# EasyEDA Pro project 单向户外电源_明月班.epro, board PCB10
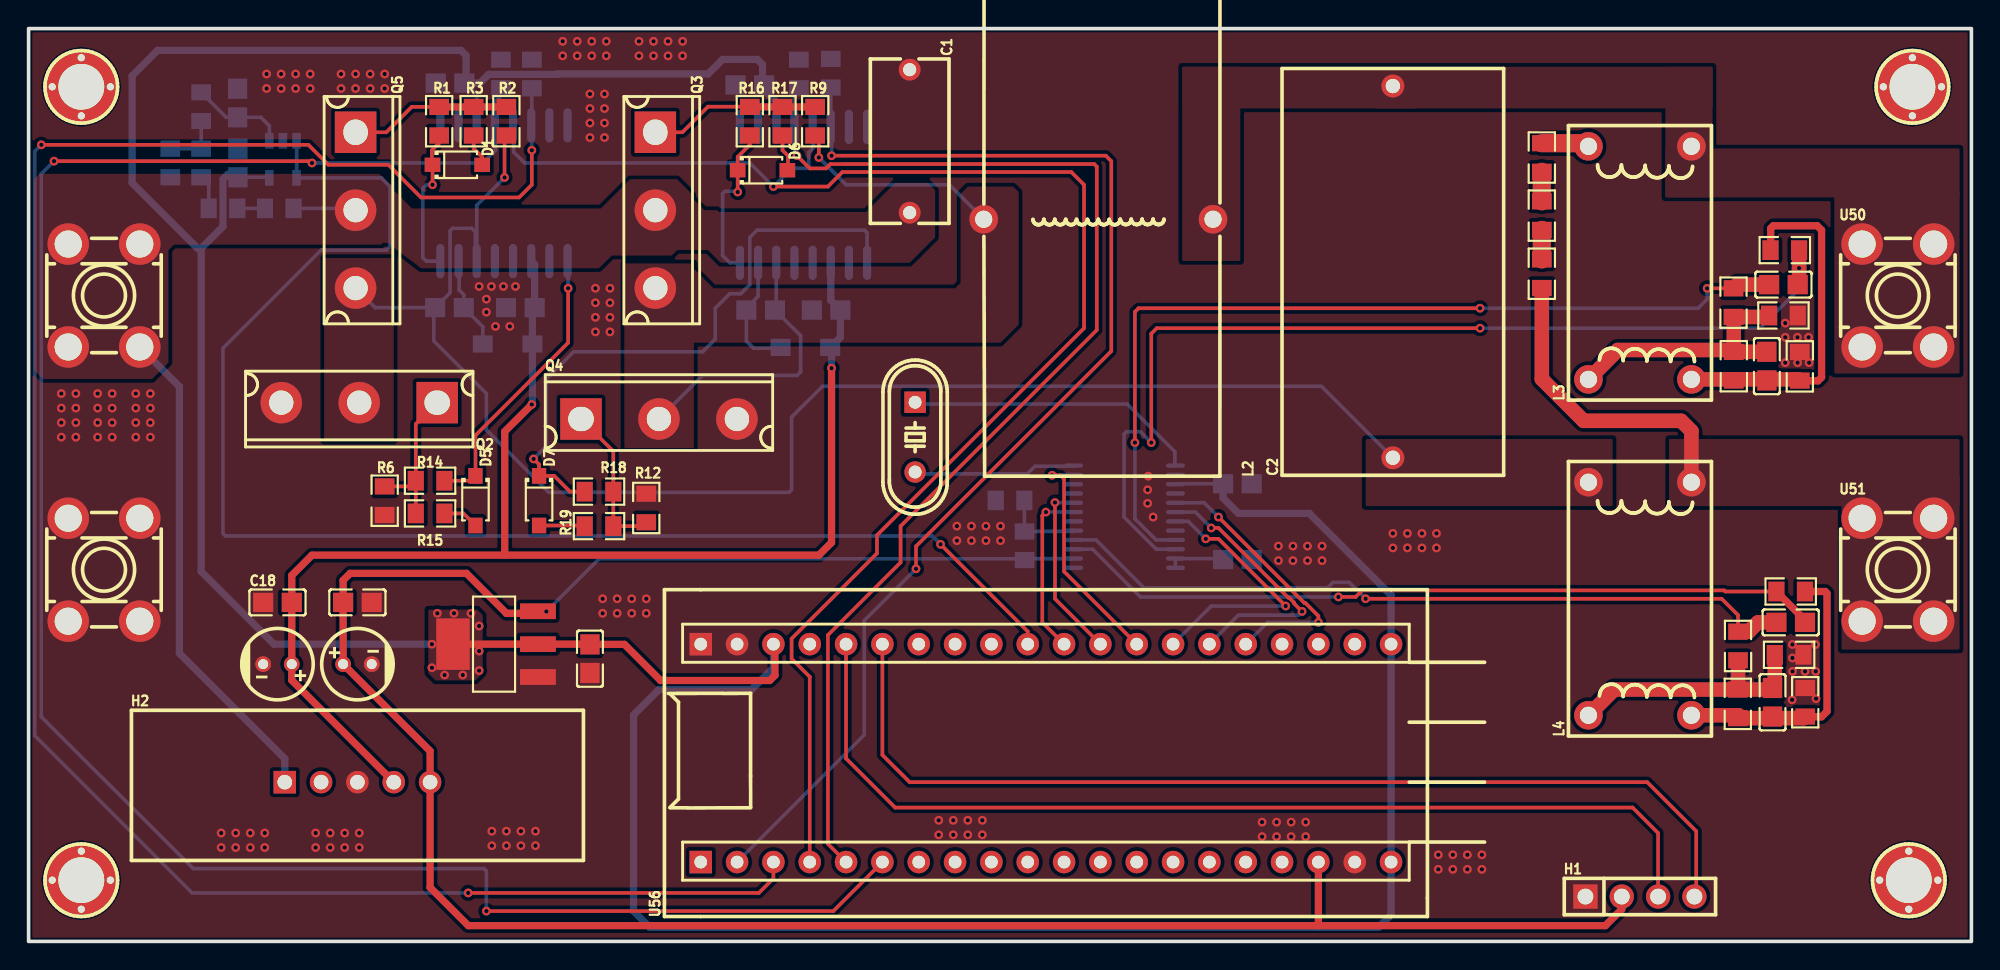
[diagram p16: board, top side]
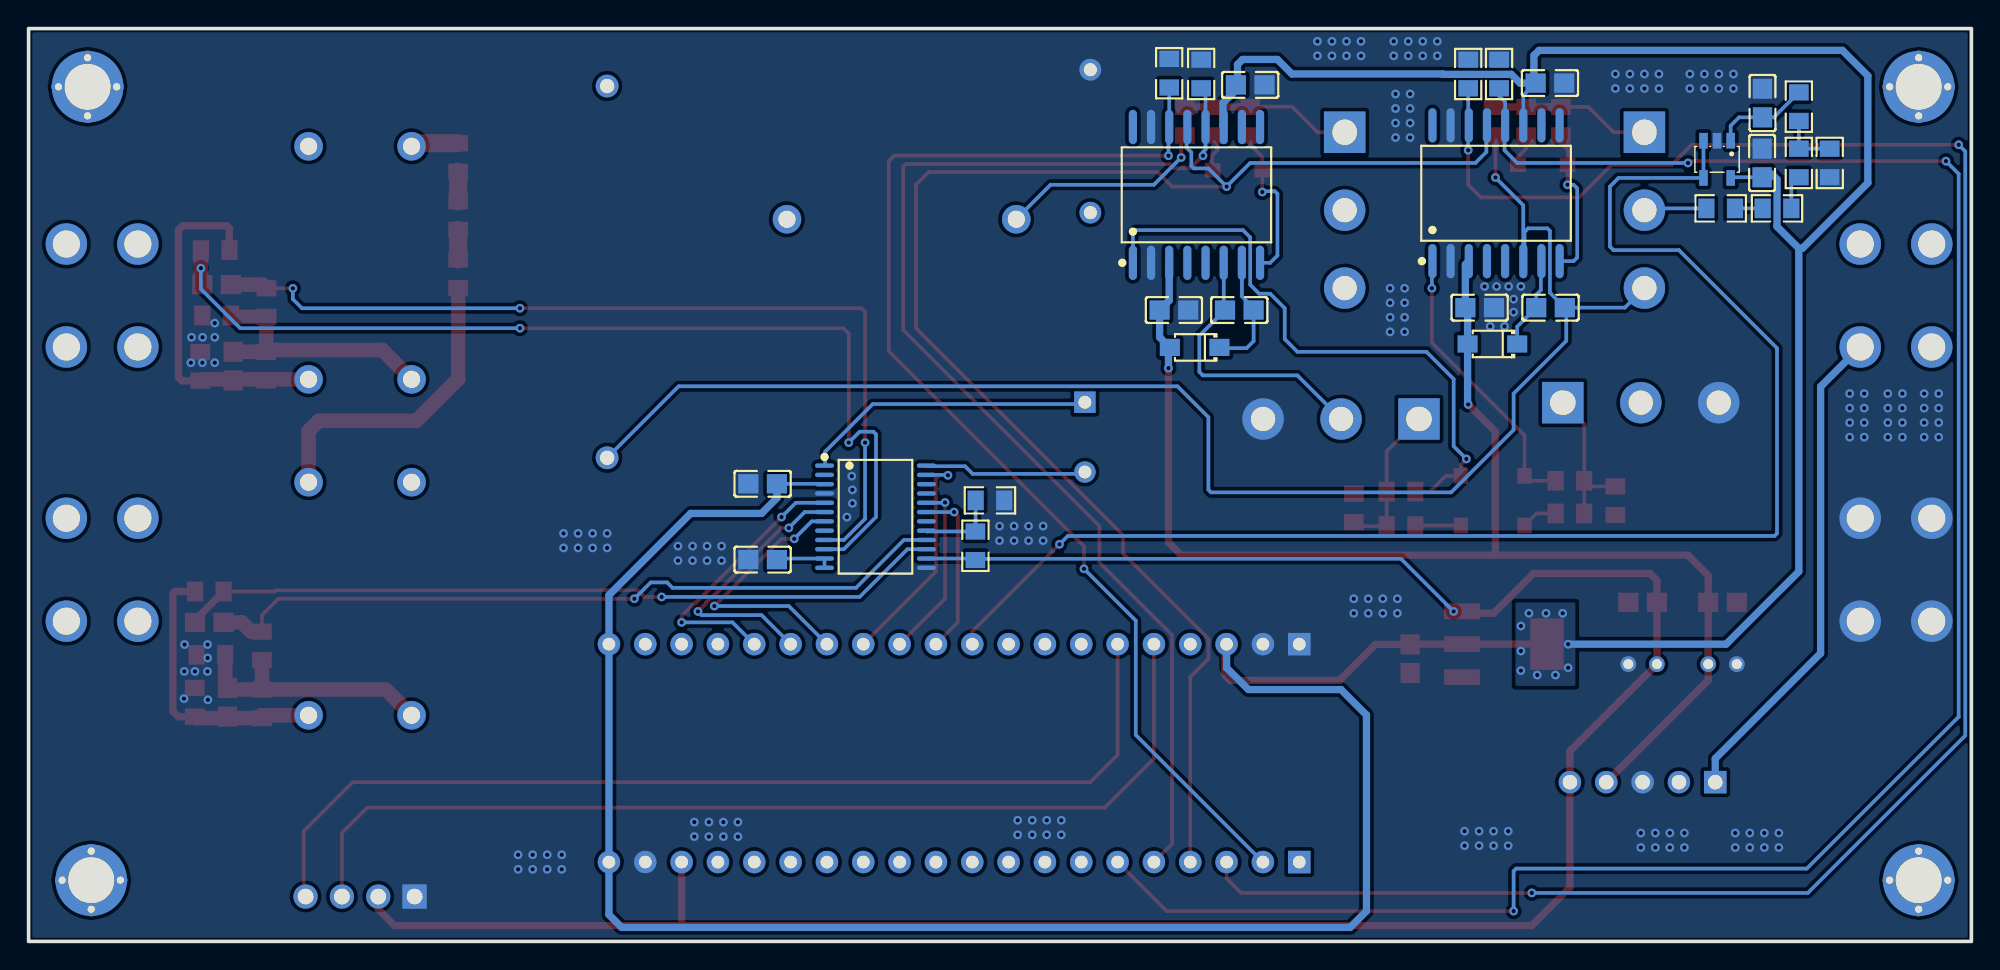
[diagram p17: board, bottom side, seen from below]

Outline 135.82 x 63.84 mm; copper layers: Top Layer, Bottom Layer. Coordinates in mm from the lower left corner of the outline.
Outline path: rectangle 0,63.84 135.82,0
Stack: Top Layer 0.035mm / Dielectric1 1.51mm FR4 er 4.5 / Bottom Layer 0.035mm

## Design rules (mm)
template: 自定义配置
spacing copperThickness1oz (default): track to track 0.102, other pairs 0.152 to 0.3
spacing copperThickness2oz: track to track 0.203, other pairs 0.152 to 0.3
track width copperThickness1oz (default): min 0.127, default 0.254, max 2.54
track width copperThickness2oz: min 0.203, default 0.254, max 2.54
differential pair differentialPair (default): width min 0.127, default 0.254, max 2.54; gap min 0.152, default 0.152
via viaSize (default): diameter min 0.5, default 0.61, max 10; hole min 0.3, default 0.305, max 6.3

## Placement (name value [footprint] x y rotation side)
C1  100nF  [CAP-TH_L11.5-W5.5-P10.00-D0.6]  61.59 55.97 270 top
C2  4.7uF  [CAP-TH_L28.5-W15.5-P26.0-D0.8]  95.38 46.82 90 top
C3  100nF  [C0805]  14.63 54.44 90 bottom
C4  100nF  [C0805]  14.6 58.64 270 bottom
C5  10uF  [C0805]  29.42 44.33 0 bottom
C6  100nF  [C0805]  34.38 44.33 0 bottom
C7  100nF  [C0805]  29.46 60.03 0 bottom
C8  10uF  [C0805]  51.18 44.16 180 bottom
C9  100nF  [C0805]  55.75 44.16 0 bottom
C10  100nF  [C0805]  50.42 59.91 0 bottom
C11  10pF  [C0805]  121.52 40.24 90 top
C12  4.7nF  [C0805]  122.68 45.94 180 top
C13  10pF  [C0805]  121.92 16.73 90 top
C14  4.7nF  [C0805]  123.19 22.31 180 top
C15  100nF  [C0805]  84.51 32.01 0 bottom
C16  100nF  [C0805]  84.51 26.7 180 bottom
C17  100uF  [CAP-TH_BD5.0-P2.00-D0.5-FD-1]  17.4 19.39 180 top
C18  100nF  [C0805]  17.4 23.71 0 top
C19  100uF  [CAP-TH_BD5.0-P2.00-D0.5-FD-1]  22.99 19.39 0 top
C20  100nF  [C0805]  22.99 23.71 180 top
C21  100nF  [C0805]  39.24 19.77 90 top
D1  1N4148W  [SOD-123F_L2.7-W1.6-LS3.8-RD]  29.97 54.32 0 top
D5  1N4148W  [SOD-123F_L2.7-W1.6-LS3.8-RD]  31.24 30.82 270 top
D6  1N4148W  [SOD-123F_L2.7-W1.6-LS3.8-RD]  51.31 53.94 0 top
D7  1N4148W  [SOD-123F_L2.7-W1.6-LS3.8-RD]  35.69 30.82 270 top
D8  FR107W  [SOD-123FL_L2.7-W1.8-LS3.8-RD]  33.49 41.79 0 bottom
D9  FR107W  [SOD-123FL_L2.7-W1.8-LS3.8-RD]  54.3 41.54 0 bottom
H1  -  [HDR-TH_4P-P2.54-V-F]  112.65 3.14 0 top
H2  -  [EG1185辅助电源]  22.99 11.14 0 top
L2  2mH  [2mH-D=36,插件脚距16]  74.8 50.51 90 top
L3  ZMPT107-1  [XFMR-TH_ZMPT107-1]  112.65 47.46 90 top
L4  ZMPT107-1  [XFMR-TH_ZMPT107-1]  112.65 23.96 90 top
P8  -  [固定孔]  131.7 59.77 0 top
P9  -  [固定孔]  3.68 59.77 0 top
P10  -  [固定孔]  131.44 4.28 0 top
P11  -  [固定孔]  3.68 4.28 0 top
Q2  K40EH5  [TO-247AC-3_L15.8-W5.0-P5.46-L]  23.11 37.68 180 top
Q3  K40EH5  [TO-247AC-3_L15.8-W5.0-P5.46-L]  43.81 51.14 270 top
Q4  K40EH5  [TO-247AC-3_L15.8-W5.0-P5.46-L]  44.07 36.54 0 top
Q5  K40EH5  [TO-247AC-3_L15.8-W5.0-P5.46-L]  22.86 51.14 270 top
R1  20R  [R0805]  28.7 57.37 90 top
R2  10K  [R0805]  33.4 57.37 270 top
R3  4.7R  [R0805]  31.11 57.37 90 top
R6  10K  [R0805]  24.89 30.82 270 top
R9  10K  [R0805]  54.99 57.37 270 top
R12  10K  [R0805]  43.18 30.31 90 top
R14  20R  [R0805]  28.07 32.22 180 top
R15  4.7R  [R0805]  28.07 29.93 180 top
R16  20R  [R0805]  50.42 57.37 90 top
R17  4.7R  [R0805]  52.7 57.37 90 top
R18  20R  [R0805]  39.88 31.46 0 top
R19  4.7R  [R0805]  39.88 29.04 0 top
R20  1K  [R0805]  12.06 58.38 90 bottom
R21  7.5K  [R0805]  9.91 54.44 90 bottom
R22  330K  [R0805]  12.06 54.44 270 bottom
R23  330K  [R0805]  17.53 51.27 180 bottom
R24  330K  [R0805]  13.59 51.27 180 bottom
R25  10K  [R0805]  33.02 60.67 270 bottom
R26  10K  [R0805]  35.18 60.67 270 bottom
R27  10K  [R0805]  53.85 60.67 270 bottom
R28  10K  [R0805]  56.08 60.72 270 bottom
R29  100K  [R0805]  105.79 46.7 90 top
R30  100K  [R0805]  105.79 50.76 90 top
R31  20K  [R0805]  105.79 54.83 90 top
R32  100R  [R0805]  119.21 40.23 90 top
R33  1K  [R0805]  122.68 43.78 0 top
R34  1K  [R0805]  123.83 40.22 90 top
R35  470R  [R0805]  119.19 44.68 270 top
R36  470R  [R0805]  122.78 48.35 180 top
R40  20R  [R0805]  119.49 16.61 90 top
R41  1K  [R0805]  124.21 16.73 90 top
R42  1K  [R0805]  123.08 20.04 0 top
R43  470R  [R0805]  119.51 20.66 270 top
R44  470R  [R0805]  123.19 24.47 0 top
R45  10K  [R0805]  68.62 30.85 180 bottom
R46  5.1K  [R0805]  69.63 27.67 270 bottom
U48  T44001  [CONN-TH_T44001]  5.27 45.17 0 top
U49  T44001  [CONN-TH_T44001]  5.27 26 0 top
U50  T44001  [CONN-TH_T44001]  130.68 45.17 0 top
U51  T44001  [CONN-TH_T44001]  130.68 26 0 top
U52  LMV321IDBVR  [SOT-23-5_L3.0-W1.7-P0.95-LS2.8-BR]  17.78 54.7 90 bottom
U53  IR2110STRPBF  [SOIC-16_L10.3-W7.5-P1.27-LS10.3-BL]  33.23 52.33 180 bottom
U54  IR2110STRPBF  [SOIC-16_L10.3-W7.5-P1.27-LS10.3-BL]  54.18 52.21 180 bottom
U55  CS5463-ISZR  [SSOP-24_L8.1-W5.3-P0.65-LS7.8-BL]  76.62 29.7 270 bottom
U56  -  [STM32F103C8T6最小系统板]  77.47 13.17 90 top
U57  AMS1117-3.3  [SOT-223-3_L6.5-W3.4-P2.30-LS7.0-BR]  32.64 20.79 0 top
X1  4.096MHz  [HC-49US_L11.5-W4.5-P4.88]  61.98 35.27 270 top

## Footprints (pads in the part's own frame, mm; a bottom-side part is the same pattern mirrored in y, then rotated)
2mH-D=36,插件脚距16
  round 2 hole 1.2: 1(0,8.031) 2(0,-8.001)
C0805
  rect 1.41x1.35 smd: 1(-1,0) 2(1,0)
CAP-TH_BD5.0-P2.00-D0.5-FD-1
  round 1.1 hole 0.7: 1(-1,0) 2(1,0)
CAP-TH_L11.5-W5.5-P10.00-D0.6
  round 1.524 hole 0.914: 1(-5,0) 2(5,0)
CAP-TH_L28.5-W15.5-P26.0-D0.8
  round 1.6 hole 1: 1(-13,0) 2(13,0)
CONN-TH_T44001
  round 2.9 hole 1.9: 1(-2.5,3.6) 2(-2.5,-3.6) 3(2.5,-3.6) 4(2.5,3.6)
EG1185辅助电源
  rect 1.575x1.575 hole 1.02: 1(-5.08,0)
  round 1.575 hole 1.02: 2(-2.54,0) 3(0,0) 4(2.54,0) 5(5.08,0)
HC-49US_L11.5-W4.5-P4.88
  rect 1.5x1.5 hole 0.9: 1(-2.44,0)
  round 1.5 hole 0.9: 2(2.44,0)
HDR-TH_4P-P2.54-V-F
  rect 1.7x1.7 hole 1.1: 1(-3.81,0)
  round 1.7 hole 1.1: 2(-1.27,0) 3(1.27,0) 4(3.81,0)
R0805
  rect 1.133x1.377 smd: 1(-1,0) 2(1,0)
SOD-123F_L2.7-W1.6-LS3.8-RD
  rect 1.1x1 smd: 1(-1.735,0) 2(1.735,0)
SOD-123FL_L2.7-W1.8-LS3.8-RD
  rect 1.4x1.2 smd: 1(-1.735,0) 2(1.735,0)
SOIC-16_L10.3-W7.5-P1.27-LS10.3-BL
  oval 0.574x2.401 smd: 1(-4.445,-4.75) 2(-3.175,-4.75) 3(-1.905,-4.75) 4(-0.635,-4.75) 5(0.635,-4.75) 6(1.905,-4.75) 7(3.175,-4.75) 8(4.445,-4.75) 9(4.445,4.75) 10(3.175,4.75) 11(1.905,4.75) 12(0.635,4.75) 13(-0.635,4.75) 14(-1.905,4.75) 15(-3.175,4.75) 16(-4.445,4.75)
SOT-23-5_L3.0-W1.7-P0.95-LS2.8-BR
  rect 1.1x0.6 smd: 1(1.3,-0.95) 2(1.3,0) 3(1.3,0.95) 4(-1.3,0.95) 5(-1.3,-0.95)
SOT-223-3_L6.5-W3.4-P2.30-LS7.0-BR
  rect 2.5x1.1 smd: 1(2.97,-2.3) 2(2.97,0) 3(2.97,2.3)
  rect 2.34x3.6 smd: 4(-2.97,0)
SSOP-24_L8.1-W5.3-P0.65-LS7.8-BL
  oval 0.308x1.324 smd: 1(-3.575,-3.562) 2(-2.925,-3.562) 3(-2.275,-3.562) 4(-1.625,-3.562) 5(-0.975,-3.562) 6(-0.325,-3.562) 7(0.325,-3.562) 8(0.975,-3.562) 9(1.625,-3.562) 10(2.275,-3.562) 11(2.925,-3.562) 12(3.575,-3.562) 13(3.575,3.562) 14(2.925,3.562) 15(2.275,3.562) 16(1.625,3.562) 17(0.975,3.562) 18(0.325,3.562) 19(-0.325,3.562) 20(-0.975,3.562) 21(-1.625,3.562) 22(-2.275,3.562) 23(-2.925,3.562) 24(-3.575,3.562)
STM32F103C8T6最小系统板
  round 1.575 hole 0.889: 1(7.62,-17.78) 2(7.62,-15.24) 3(7.62,-12.7) 4(7.62,-10.16) 5(7.62,-7.62) 6(7.62,-5.08) 7(7.62,-2.54) 8(7.62,0) 9(7.62,2.54) 10(7.62,5.08) 11(7.62,7.62) 12(7.62,10.16) 13(7.62,12.7) 14(7.62,15.24) 15(7.62,17.78) 16(7.62,20.32) 17(7.62,22.86) 18(7.62,25.4) 19(7.62,27.94) 22(-7.62,27.94) 23(-7.62,25.4) 24(-7.62,22.86) 25(-7.62,20.32) 26(-7.62,17.78) 27(-7.62,15.24) 28(-7.62,12.7) 29(-7.62,10.16) 30(-7.62,7.62) 31(-7.62,5.08) 32(-7.62,2.54) 33(-7.62,0) 34(-7.62,-2.54) 35(-7.62,-5.08) 36(-7.62,-7.62) 37(-7.62,-10.16) 38(-7.62,-12.7) 39(-7.62,-15.24) 40(-7.62,-17.78)
  rect 1.575x1.575 hole 0.889: 20(7.62,30.48) 21(-7.62,30.48)
TO-247AC-3_L15.8-W5.0-P5.46-L
  rect 2.9x2.9 hole 1.785x1.7: 1(-5.45,0)
  round 2.9 hole 1.7: 2(0,0) 3(5.45,0)
XFMR-TH_ZMPT107-1
  round 2 hole 1.2: 1(-8.15,3.6) 2(-8.15,-3.6) 3(8.15,3.6) 4(8.15,-3.6)
固定孔
  round 1 hole 0.5x0.505: 1(-2.032,0) 3(2.032,0)
  round 1 hole 0.505x0.5: 2(0,-2.032) 4(0,2.032)
  round 5 hole 3.205x3.2: 5(0,0)

## Nets
As in the schematic.

Pads without a net: H2 2; P8 1 2 3 4 5; P9 1 2 3 4 5; P10 1 2 3 4 5; P11 1 2 3 4 5; U53 4 5 9 10 16; U54 4 5 9 10 16; U55 2 8 18 21 22; U56 2 3 4 12 13 14 17 21 27 28 29 30 31 32 33 34 35 36 37

## Via types
v1: diameter 0.61, hole 0.305, Top Layer to Bottom Layer, 226 vias

## Routing (per net, layer and track width the routed paths; a pad name or vN(x,y) marks a point on that pad's centre or on a via; arc(x,y) is an arc through that point)
3.3V: length 267.5
  Top Layer w0.508: U57.4 U57.2 39.23,20.79 C21.2 41.66,20.77 44.18,18.25 51.82,18.25 52.17,18.61 52.17,20.68 52.07,20.79
  Bottom Layer w0.254: 14.65,53.44 16.78,53.44 U52.5 ; C15.1 80.21,32.01 U55.3 ; C7.2 31.33,59.17 U53.11
  Bottom Layer w0.508: 52.07,20.79 52.07,19.14 50.55,17.61 44.07,17.61 42.29,15.84 42.29,2.12 43.43,0.98 94.36,0.98 95.25,1.87 U56.40 U56.1 95.25,24.22 89.53,29.93 84.58,29.93 83.51,31.01 C15.1 ; 14.14,53.44 C3.1 14.65,53.44 ; 12.06,48.48 11.81,48.48 7.24,53.05 7.24,60.54 9.02,62.32 30.23,62.32 30.58,61.96 30.58,60.15 C7.2 31.56,60.03 32.16,60.64 36.93,60.64 36.96,60.67 47.5,60.67 48.51,61.68 50.95,61.68 51.31,61.32 51.31,60.02 C10.2 51.42,59.54 52.32,58.64 52.32,57.02 U54.11 ; 12.06,48.48 13.59,50 13.59,53.3 13.95,53.66 14.14,53.47 ; 12.06,48.48 12.06,25.87 17.15,20.79 v1(28.19,20.79)
  vias: v1(28.19,19.14) v1(28.57,22.95) v1(29.08,18.63) v1(29.74,22.95) v1(30.35,18.63) v1(30.93,22.95) v1(31.5,22.06) v1(31.5,20.31) v1(31.5,18.94)
5V: length 167.7
  Top Layer w0.508: 90.17,1.1 30.73,1.1 28.07,3.77 H2.5 28.07,13.31 C19.1 C20.2 21.99,25.25 22.48,25.74 30.61,25.74 33.4,22.95 35.47,22.95 U57.3 ; 90.17,1.1 90.17,5.55 ; 90.17,1.1 110.24,1.1 111.38,2.25 H1.2
  Bottom Layer w0.254: v1(36.19,23.08) 39.88,26.76 69.54,26.76 R46.2 69.74,26.78 U55.14
15V: length 97.6
  Top Layer w0.508: 33.28,27.01 33.28,35.66 v1(35.18,37.55) ; 33.28,27.01 55.24,27.01 56.13,27.9 v1(56.13,40.09) ; 33.28,27.01 19.81,27.01 18.4,25.6 C18.2 C17.1 18.4,18.27 H2.4
  Bottom Layer w0.508: U53.3 35.38,47.34 C6.2 35.22,44.17 35.22,41.96 ; v1(56.13,40.09) 56.13,41.45 D9.2 56.75,42.26 C9.2 56.08,44.83 U54.3 ; v1(35.18,37.55) 35.22,37.6 D8.2
400V: length 39
  Bottom Layer w0.254: R23.1 22.73,51.27 Q5.2
  Bottom Layer w0.508: U48.3 10.54,38.8 10.54,20.15 17.91,12.79 H2.1
GND-400V:
  vias: v1(2.29,38.32) v1(2.29,37.3) v1(2.29,36.28) v1(2.29,35.27) v1(3.3,38.32) v1(3.3,37.3) v1(3.3,36.28) v1(3.3,35.27) v1(4.83,38.32) v1(4.83,37.3) v1(4.83,36.28) v1(4.83,35.27) v1(5.84,38.32) v1(5.84,37.3) v1(5.84,36.28) v1(5.84,35.27) v1(7.49,38.32) v1(7.49,37.3) v1(7.49,36.28) v1(7.49,35.27) v1(8.51,38.32) v1(8.51,37.3) v1(8.51,36.28) v1(8.51,35.27) v1(13.46,7.58) v1(13.46,6.57) v1(14.48,7.58) v1(14.48,6.57) v1(15.49,7.58) v1(15.49,6.57) v1(16.51,7.58) v1(16.51,6.57) v1(16.64,60.67) v1(16.64,59.65) v1(17.65,60.67) v1(17.65,59.65) v1(18.67,60.67) v1(18.67,59.65) v1(19.68,60.67) v1(19.68,59.65) v1(20.07,7.58) v1(20.07,6.57) v1(21.08,7.58) v1(21.08,6.57) v1(21.84,60.67) v1(21.84,59.65) v1(22.1,7.58) v1(22.1,6.57) v1(22.86,60.67) v1(22.86,59.65) v1(23.11,7.58) v1(23.11,6.57) v1(23.88,60.67) v1(23.88,59.65) v1(24.89,60.67) v1(24.89,59.65) v1(31.5,45.81) v1(32,44.92) v1(32,44.01) v1(32.35,45.81) v1(32.38,7.71) v1(32.38,6.69) v1(32.64,43.01) v1(33.19,45.81) v1(33.4,7.71) v1(33.4,6.69) v1(33.64,43.01) v1(34.04,45.81) v1(34.42,7.71) v1(34.42,6.69) v1(35.43,7.71) v1(35.43,6.69) v1(37.34,62.95) v1(37.34,61.94) v1(38.35,62.95) v1(38.35,61.94) v1(39.24,59.27) v1(39.24,58.25) v1(39.24,57.24) v1(39.24,56.22) v1(39.37,62.95) v1(39.37,61.94) v1(39.62,45.68) v1(39.62,44.67) v1(39.62,43.65) v1(39.62,42.63) v1(40.13,23.96) v1(40.13,22.95) v1(40.26,59.27) v1(40.26,58.25) v1(40.26,57.24) v1(40.26,56.22) v1(40.39,62.95) v1(40.39,61.94) v1(40.64,45.68) v1(40.64,44.67) v1(40.64,43.65) v1(40.64,42.63) v1(41.15,23.96) v1(41.15,22.95) v1(42.16,23.96) v1(42.16,22.95) v1(42.67,62.95) v1(42.67,61.94) v1(43.18,23.96) v1(43.18,22.95) v1(43.69,62.95) v1(43.69,61.94) v1(44.7,62.95) v1(44.7,61.94) v1(45.72,62.95) v1(45.72,61.94) v1(63.63,8.47) v1(63.63,7.45) v1(64.64,8.47) v1(64.64,7.45) v1(64.9,29.04) v1(64.9,28.03) v1(65.66,8.47) v1(65.66,7.45) v1(65.91,29.04) v1(65.91,28.03) v1(66.67,8.47) v1(66.67,7.45) v1(66.93,29.04) v1(66.93,28.03) v1(67.95,29.04) v1(67.95,28.03) v1(78.23,31.58) v1(78.23,30.64) v1(78.27,32.54) v1(78.61,29.68) v1(86.23,8.34) v1(86.23,7.33) v1(87.25,8.34) v1(87.25,7.33) v1(87.38,27.65) v1(87.38,26.63) v1(88.27,8.34) v1(88.27,7.33) v1(88.39,27.65) v1(88.39,26.63) v1(89.28,8.34) v1(89.28,7.33) v1(89.41,27.65) v1(89.41,26.63) v1(90.42,27.65) v1(90.42,26.63) v1(95.38,28.54) v1(95.38,27.52) v1(96.39,28.54) v1(96.39,27.52) v1(97.41,28.54) v1(97.41,27.52) v1(98.42,28.54) v1(98.42,27.52) v1(98.55,6.06) v1(98.55,5.04) v1(99.57,6.06) v1(99.57,5.04) v1(100.58,6.06) v1(100.58,5.04) v1(101.6,6.06) v1(101.6,5.04) v1(122.81,43.24) v1(122.81,42.25) v1(122.81,40.47) v1(123.31,20.76) v1(123.31,19.82) v1(123.32,18.88) v1(123.29,16.9) v1(123.66,42.25) v1(123.67,40.47) v1(124.19,18.88) v1(124.44,42.25) v1(124.48,40.47) v1(124.92,20.76) v1(124.94,18.88) v1(124.96,16.98)
ADC-VIN: length 101.2
  Top Layer w0.254: U56.11 69.85,21.68 v1(63.75,27.77)
  Bottom Layer w0.254: U52.3 U52.4 24.67,53.4 25.27,52.79 25.27,48.6 25.02,48.35 20.45,48.35 13.59,41.49 13.59,28.54 13.77,28.36 63.17,28.36 v1(63.75,27.77)
AI1: length 109
  Top Layer w0.254: v1(33.27,53.43) 33.27,56.24 R2.2
  Bottom Layer w0.254: Q5.3 24.23,44.33 C5.1 ; C2.1 90.38,38.82 55.5,38.82 53.34,36.66 53.34,31.58 53.16,31.41 36.37,31.41 32,35.78 32,38.32 28.32,42 28.32,44.22 C5.1 ; C5.1 29.46,45.37 29.46,49.69 29.64,49.87 30.99,49.87 31.24,49.62 31.24,47.66 U53.6 31.33,51.48 v1(33.27,53.43)
AI2: length 21.9
  Top Layer w1.016: R29.1 105.79,39.33 108.71,36.41 115.53,36.41 116.25,35.69 L4.4
CS: length 19.1
  Top Layer w0.254: v1(82.3,28.16) 83.18,28.16 v1(87.88,23.46)
  Bottom Layer w0.254: v1(87.88,23.46) 82.68,23.46 80.01,20.79 ; v1(82.3,28.16) 81.07,29.38 U55.7
HO1: length 10.6
  Top Layer w0.254: v1(28.24,52.92) D1.1 28.19,54.36 28.19,55.33 28.7,55.84 R1.1
  Bottom Layer w0.254: U53.8 27.81,47.58 27.56,47.83 27.56,52.67 27.81,52.92 v1(28.24,52.92)
HO2: length 11.2
  Top Layer w0.254: R16.1 50.42,55.71 49.57,54.87 D6.1 v1(49.57,52.41)
  Bottom Layer w0.254: U54.8 49.02,47.46 48.51,47.97 48.51,52.29 48.69,52.47 49.52,52.47 v1(49.57,52.41)
I2C1-SCL: length 71.4
  Top Layer w0.254: H1.3 113.92,7.58 112.14,9.36 60.58,9.36 57.15,12.79 U56.16
I2C1-SDA: length 71.5
  Top Layer w0.254: H1.4 116.59,3.26 116.59,7.71 113.16,11.14 61.59,11.14 59.69,13.04 U56.15
INT: length 12.5
  Top Layer w0.254: v1(71.75,30.7) 71.75,23.96 U56.9
  Bottom Layer w0.254: U55.20 71.75,30.68
LO1: length 20
  Top Layer w0.254: R14.1 30.9,32.22 D5.1 31.24,35.39 37.72,41.87 v1(37.72,45.68)
  Bottom Layer w0.254: 37.68,47.58 37.72,47.54 v1(37.72,45.68)
LO2: length 43.1
  Top Layer w0.254: R18.1 37.85,31.46 36.75,32.56 D7.1 35.69,33.36 v1(35.31,33.74)
  Bottom Layer w0.254: U54.1 58.62,49.57 58.44,49.75 50.93,49.75 50.42,49.24 50.42,45.93 49.79,45.3 49.02,45.3 48.01,44.28 48.01,42.13 47.12,41.24 38.1,41.24 36.19,39.33 36.19,34.63 v1(35.31,33.74)
MISO: length 19.2
  Top Layer w0.254: v1(82.68,28.92) 83.18,28.92 88.06,24.04 88.13,24.04 88.47,23.7 88.47,23.63 v1(89.03,23.08)
  Bottom Layer w0.254: U55.6 81.57,30.03 v1(82.68,28.92) ; U56.6 84.58,22.82 88.77,22.82 v1(89.03,23.08)
MOSI: length 16.1
  Top Layer w0.254: U56.8 72.39,25.87 72.39,32.35 72.14,32.6 v1(71.55,32.6)
  Bottom Layer w0.254: U55.23 71.58,32.63 v1(71.55,32.6)
RST: length 11.9
  Top Layer w0.254: 72.39,20.79 70.87,22.31 70.87,29.77 v1(71.12,30.03)
  Bottom Layer w0.254: U55.19 v1(71.12,30.03)
SCLK: length 19.4
  Top Layer w0.254: v1(90.17,22.31) 90.17,22.76 89.27,23.66 89.2,23.66 v1(83.18,29.68)
  Bottom Layer w0.254: v1(90.17,22.31) 86.61,22.31 U56.5 ; v1(83.18,29.68) 82.19,30.68 U55.5
SD-PB15: length 105.9
  Top Layer w0.254: U56.24 54.61,18.5 53.34,19.77 53.34,21.17 59.31,27.14 59.31,28.41 73.79,42.89 73.79,52.92 72.9,53.81 56.9,53.81 55.88,52.79 v1(52.07,52.79)
  Bottom Layer w0.254: U53.13 33.91,57.04 33.91,55.21 34.67,54.44 50.42,54.44 v1(52.07,52.79) 53.34,54.06 54.36,54.06 54.54,54.24 54.54,55.18 54.86,55.51 54.86,56.91 U54.13
TIM1-CH1: length 83.4
  Top Layer w0.254: v1(53.72,54.95) 54.61,54.06 55.75,54.06 56.06,54.37 74.5,54.37 74.68,54.19 74.68,42.76 60.96,29.04 60.96,26.5 55.88,21.42 55.88,6.82 U56.25
  Bottom Layer w0.254: v1(53.72,54.95) 53.72,55.21 53.54,55.39 U54.12 53.54,59.36 R27.2
TIM1-CH1N: length 84.4
  Top Layer w0.254: v1(56.13,54.95) 75.31,54.95 75.69,54.57 75.69,41.29 62.04,27.63 v1(62.04,26.06)
  Bottom Layer w0.254: v1(56.13,54.95) 56.13,56.91 U54.14 R28.2 ; U56.22 58.42,14.44 58.42,22.44 v1(62.04,26.06)
TIM1-CH2: length 142.9
  Top Layer w0.254: v1(19.81,54.44) 19.68,54.57 v1(1.78,54.57) ; v1(32,2.12) 56.26,2.12 U56.26
  Bottom Layer w0.254: 32.6,57.45 32.6,58.72 33.02,59.14 R25.2 ; 32.6,57.45 32.6,57.08 ; 32.6,57.45 32.64,57.41 32.64,55.33 31.75,54.44 v1(19.81,54.44) ; v1(32,2.12) 32,4.91 31.82,5.09 11.5,5.09 0.89,15.71 0.89,53.68 v1(1.78,54.57)
TIM1-CH2N: length 142.2
  Top Layer w0.254: 52.07,5.55 52.07,4.41 51.05,3.39 v1(30.73,3.39) ; v1(35.18,55.33) 35.18,52.92 34.29,52.03 27.43,52.03 25.15,54.32 20.95,54.32 19.56,55.71 v1(0.89,55.71)
  Bottom Layer w0.254: R26.2 35.18,57.12 U53.14 35.18,57.04 v1(35.18,55.33) ; v1(0.89,55.71) 0.43,55.25 0.43,14.39 11.43,3.39 v1(30.73,3.39)
VS2: length 34.7
  Top Layer w0.254: R9.2 55.24,56.11 v1(55.24,54.83)
  Bottom Layer w0.254: U54.6 52.27,44.25 C8.1 53.98,42.36 53.98,39.84 53.72,39.59 47.12,39.59 Q4.2 ; 66.79,50.51 64.37,52.92 57.15,52.92 v1(55.24,54.83)
$1N804: length 2.3
  Top Layer w0.254: D1.2 31.71,54.87 31.11,55.46 R3.1
$1N805: length 11.3
  Top Layer w0.254: Q5.1 25.01,56.59 26.78,58.37 R1.2
  Top Layer w0.508: R1.2 R3.2 R2.1
$1N811: length 10.7
  Top Layer w0.254: R14.2 26.67,31.82 R6.1 ; R14.2 27.07,36.18 Q2.1 ; R14.2 R15.2
$1N816: length 12.2
  Top Layer w0.254: 50.66,58.37 50.64,58.38 47.5,58.38 45.71,56.59 Q3.1
  Top Layer w0.508: R16.2 R17.2 R9.1
$1N820: length 10.8
  Top Layer w0.254: Q4.1 40.88,34.28 R18.2 R19.2 42.91,29.04 R12.1
$1N1530: length 2.5
  Top Layer w0.254: D5.2 30.4,29.93 R15.1
$1N1623: length 2.6
  Top Layer w0.254: D6.2 53.09,53.98 53.09,54.95 52.7,55.33 R17.1
$1N1905: length 3.2
  Top Layer w0.254: D7.2 38.83,29.09 R19.1
$1N3599: length 6.8
  Bottom Layer w0.254: U52.1 16.83,57.05 16.24,57.64 C4.2 13.81,57.64 R20.2
$1N3773: length 1.9
  Bottom Layer w0.254: R24.1 R23.2
$1N3777: length 2.4
  Bottom Layer w0.254: R24.2 12.59,52.92 R22.2
$1N3784: length 4.1
  Bottom Layer w0.254: R20.1 R22.1 R21.2
$1N4444: length 6.5
  Bottom Layer w0.254: U53.7 30.1,47.54 30.1,45.55 30.42,45.23 C5.2 31.75,43 D8.1
$1N5054: length 8.4
  Bottom Layer w0.254: U54.7 51,45.12 50.42,44.54 50.42,44.4 C8.2 50.18,41.98 50.67,41.49 52.51,41.49 D9.1
$1N6302: length 2.1
  Top Layer w1.27: R30.1 R29.2
$1N6306: length 2.1
  Top Layer w1.27: R31.1 R30.2
$1N6311: length 3.3
  Top Layer w1.27: 109.05,55.61 108.83,55.83 R31.2
$1N6556: length 18.2
  Top Layer w1.016: 119.21,41.36 119.21,43.66 R35.2 121.58,43.68 R33.1 ; 119.21,41.36 111.1,41.36 L3.1 ; 119.21,41.36 119.38,41.36 ; C11.2 119.38,41.24
$1N6599: length 24.8
  Top Layer w0.508: 123.84,39.2 125.09,39.2 125.35,39.46 125.35,49.75 125.04,50.05 121.97,50.05 121.79,49.87 121.79,48.36 R36.2
  Top Layer w1.016: R34.1 123.74,39.31 L3.2
$1N6618: length 70.7
  Top Layer w0.254: v1(78.49,34.89) 78.49,42.51 78.87,42.89 v1(101.47,42.89) ; 123.78,46.03 C12.1
  Top Layer w1.016: R36.1 v1(123.78,47.09) 123.78,46.03
  Bottom Layer w0.254: v1(101.47,42.89) 121.03,42.89 123.78,45.63 v1(123.78,47.09) ; v1(78.49,34.89) 77.72,35.65 76.76,35.65 76.58,35.47 76.58,29.68 78.83,27.43 U55.10
$1N6632: length 63.5
  Top Layer w0.254: v1(77.34,34.89) 77.34,44.03 77.6,44.28 v1(101.47,44.28) ; R35.1 v1(117.35,45.68)
  Top Layer w1.016: R35.1 119.45,45.94 C12.2
  Bottom Layer w0.254: v1(101.47,44.28) 116.71,44.28 117.35,44.92 v1(117.35,45.68) ; v1(77.34,34.89) 77.34,29.55 78.82,28.08 U55.9
$1N6969: length 18.1
  Top Layer w1.016: R40.2 121.81,17.61 C13.2 122.08,17.88 R42.1 ; R40.2 119.51,17.63 R43.2 ; R40.2 110.85,17.61 L4.1
$1N6975: length 19.9
  Top Layer w0.508: R44.2 125.6,24.47 125.73,24.35 125.73,16.09 125.35,15.71 124.22,15.71 R41.1
  Top Layer w1.016: 119.74,15.61 119.54,15.81 L4.2 ; 119.74,15.61 124.09,15.61 R41.1 ; 119.74,15.61 R40.1
$1N6981: length 53.7
  Top Layer w0.254: v1(91.57,24.09) 92.77,24.09 93.23,24.55 118.54,24.55 118.62,24.47 R44.1
  Top Layer w0.508: C14.1 124.19,22.47 R44.1
  Bottom Layer w0.254: v1(91.57,24.09) 77.72,24.09 74.39,27.43 U55.15
$1N6985: length 53.1
  Top Layer w0.254: R43.1 119.51,22.82 118.36,23.96 v1(93.47,23.96)
  Top Layer w1.016: C14.2 120.9,22.31 120.25,21.66 R43.1
  Bottom Layer w0.254: v1(93.47,23.96) 92.33,25.11 91.19,25.11 90.8,24.73 77.98,24.73 74.63,28.08 U55.16
$1N7319: length 5.6
  Bottom Layer w0.254: U55.17 73,28.67 R46.1 69.62,28.69 R45.1
$1N7435: length 20.5
  Bottom Layer w0.254: 61.98,37.58 76.81,37.58 80.14,34.25 80.14,33.32 U55.1
$1N7441: length 11.3
  Bottom Layer w0.254: 61.98,32.7 69.82,32.7 70.36,33.24 73.01,33.24 U55.24
$1N7506: length 4
  Bottom Layer w0.254: U55.12 U55.11 83.43,26.78 C16.2

## Copper pours and planes (outline as drawn; the poured copper is in the pictures)
3.3V on Top Layer: 27.94,23.2 31.37,23.2 31.75,22.82 31.75,18.76 31.24,18.25 28.45,18.25 27.94,18.76
3.3V on Bottom Layer: 27.69,23.71 31.88,23.71 31.88,17.87 27.69,17.87
400V on Top Layer: 42.04,53.3 45.34,53.3 46.23,52.41 46.23,52.16 47.24,51.14 48.14,51.14 48.27,51.02 58.55,51.02 60.58,53.05 62.86,53.05 63.37,52.54 63.37,49.24 61.59,47.46 48.39,47.46 47.5,48.35 44.45,48.35 42.04,50.76
400V on Top Layer: 21.34,53.3 24.77,53.3 26.8,51.27 40,51.27 42.04,53.3 45.31,53.3 46.41,52.2 46.41,49.42 44.96,47.97 40.77,47.97 39.88,47.08 27.43,47.08 25.09,48.86 24.26,48.86 21.34,51.78
400V on Top Layer: 24.51,53.68 25.46,52.73 25.46,49.55 24.64,48.73 10.16,48.73 9.78,48.35 9.78,40.47 8.64,39.33 1.02,39.33 0.38,39.97 0.38,53.3 0.76,53.68
GND-400V on Top Layer: 0,63.84 135.82,63.84 135.82,0 0,0
GND-400V on Bottom Layer: 0,63.84 135.82,63.84 135.82,0 0,0
AC1 on Top Layer: 126.24,52.41 135,52.41 135,39.71 126.24,39.71
AC1 on Top Layer: 80.64,61.18 97.03,61.18 97.03,58.25 80.64,58.25
AC1 on Top Layer: 114.43,61.18 117.73,61.18 117.73,52.03 114.43,52.03
AC1 on Top Layer: 114.43,55.46 135,55.46 135,52.03 114.43,52.03
AC1 on Top Layer: 94.1,61.18 117.73,61.18 117.73,58.25 94.1,58.25
AC1 on Top Layer: 80.64,61.18 84.71,61.18 84.71,47.59 80.64,47.59
AI1 on Top Layer: 20.66,47.8 25.53,47.8 25.53,35.01 20.66,35.01
AI1 on Top Layer: 93.47,35.14 110.74,35.14 110.74,30.44 93.47,30.44
AI2 on Top Layer: 114.68,35.14 135,35.14 135,30.44 114.68,30.44
AI2 on Top Layer: 126.75,32.6 135,32.6 135,20.41 126.75,20.41
VS2 on Top Layer: 41.78,47.33 46.41,47.33 46.41,47.15 47.88,45.68 64.77,45.68 65.15,46.06 65.15,52.29 65.66,52.79 68.83,52.79 69.21,52.41 69.21,43.14 67.95,41.87 46.35,41.87 41.78,46.44
VS2 on Top Layer: 41.64,47.42 46.51,47.42 46.51,34.5 41.64,34.5
